# EAGLE schematic 40x24 (EAGLE 6.2), part 2 of 2
## Sheet 1 of 4 (continued)
### Nets (continued)
X5: Q29.1(G) ; also sheet 2
X6: Q30.1(G) ; also sheet 2
X7: Q31.1(G) ; also sheet 2
X8: Q32.1(G) ; also sheet 2
X9: Q33.1(G) ; also sheet 2
X10: Q34.1(G) ; also sheet 2
X11: Q35.1(G) ; also sheet 2
X12: Q36.1(G) ; also sheet 2
X13: Q37.1(G) ; also sheet 2
X14: Q38.1(G) ; also sheet 2
X15: Q39.1(G) ; also sheet 2
X16: Q40.1(G) ; also sheet 2
X17: Q41.1(G) ; also sheet 2
X18: Q42.1(G) ; also sheet 2
X19: Q43.1(G) ; also sheet 2
X20: Q44.1(G) ; also sheet 2
X21: Q45.1(G) ; also sheet 2
X22: Q46.1(G) ; also sheet 2
X23: Q47.1(G) ; also sheet 2
X24: Q48.1(G) ; also sheet 2
X25: Q49.1(G) ; also sheet 2
X26: Q50.1(G) ; also sheet 2
X27: Q51.1(G) ; also sheet 2
X28: Q52.1(G) ; also sheet 2
X29: Q53.1(G) ; also sheet 2
X30: Q54.1(G) ; also sheet 2
X31: Q55.1(G) ; also sheet 2
X32: Q56.1(G) ; also sheet 2
X33: Q57.1(G) ; also sheet 2
X34: Q58.1(G) ; also sheet 2
X35: Q59.1(G) ; also sheet 2
X36: Q60.1(G) ; also sheet 2
X37: Q61.1(G) ; also sheet 2
X38: Q62.1(G) ; also sheet 2
X39: Q63.1(G) ; also sheet 2
X40: Q64.1(G) ; also sheet 2
Y1: Q24.1(G) ; also sheet 2
Y2: Q23.1(G) ; also sheet 2
Y3: Q22.1(G) ; also sheet 2
Y4: Q21.1(G) ; also sheet 2
Y5: Q20.1(G) ; also sheet 2
Y6: Q19.1(G) ; also sheet 2
Y7: Q18.1(G) ; also sheet 2
Y8: Q17.1(G) ; also sheet 2
Y9: Q16.1(G) ; also sheet 2
Y10: Q15.1(G) ; also sheet 2
Y11: Q14.1(G) ; also sheet 2
Y12: Q13.1(G) ; also sheet 2
Y13: Q12.1(G) ; also sheet 2
Y14: Q11.1(G) ; also sheet 2
Y15: Q10.1(G) ; also sheet 2
Y16: Q9.1(G) ; also sheet 2
Y17: Q8.1(G) ; also sheet 2
Y18: Q7.1(G) ; also sheet 2
Y19: Q6.1(G) ; also sheet 2
Y20: Q5.1(G) ; also sheet 2
Y21: Q4.1(G) ; also sheet 2
Y22: Q3.1(G) ; also sheet 2
Y23: Q1.1(G) ; also sheet 2
Y24: Q65.1(G) ; also sheet 2
Unconnected: X2.3

## Sheet 2 of 4
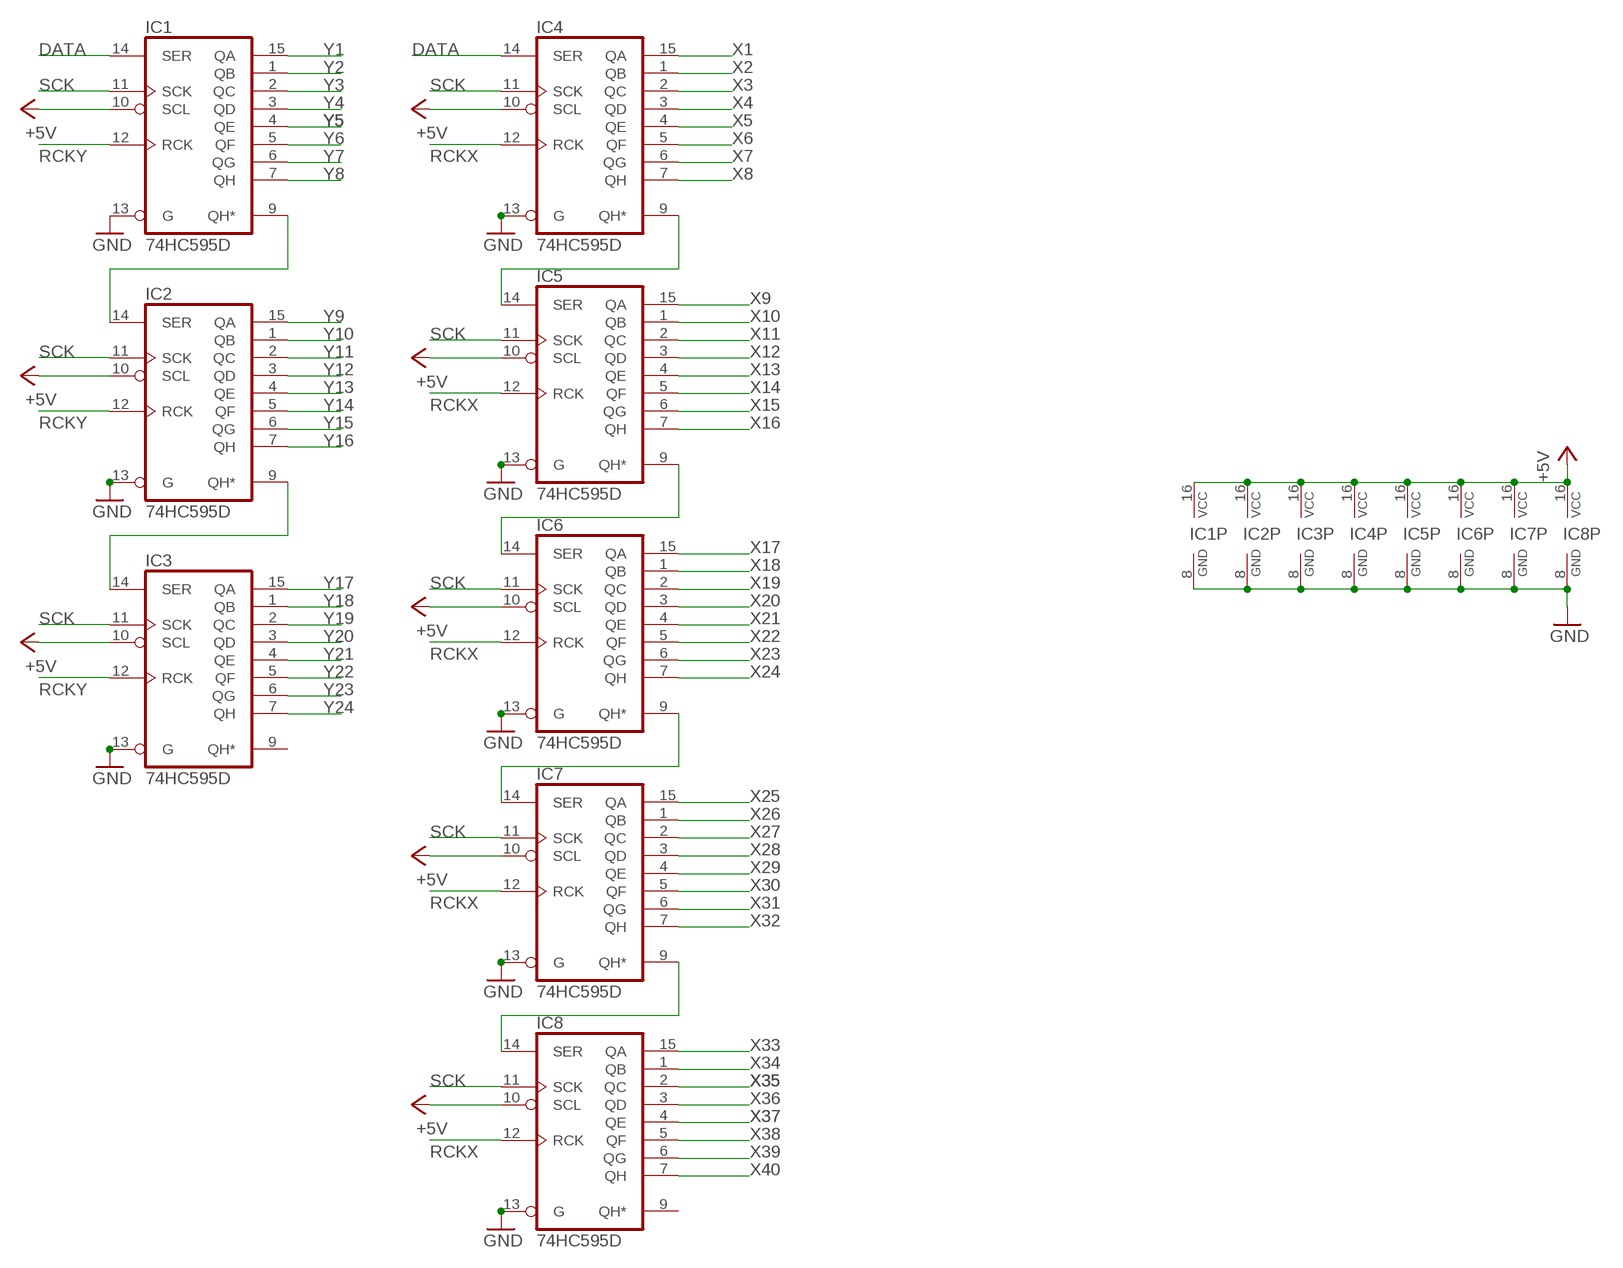
[diagram p1: schematic, sheet 2]

### Parts
IC1  74HC595D  [SO16]
IC2  74HC595D  [SO16]
IC3  74HC595D  [SO16]
IC4  74HC595D  [SO16]
IC5  74HC595D  [SO16]
IC6  74HC595D  [SO16]
IC7  74HC595D  [SO16]
IC8  74HC595D  [SO16]

### Nets
+5V: IC1.10(SCL) IC1.16(VCC) IC2.10(SCL) IC2.16(VCC) IC3.10(SCL) IC3.16(VCC) IC4.10(SCL) IC4.16(VCC) IC5.10(SCL) IC5.16(VCC) IC6.10(SCL) IC6.16(VCC) IC7.10(SCL) IC7.16(VCC) IC8.10(SCL) IC8.16(VCC) ; also sheet 1,3,4
DATA: IC1.14(SER) IC4.14(SER) ; also sheet 3
GND: IC1.8(GND) IC1.13(G) IC2.8(GND) IC2.13(G) IC3.8(GND) IC3.13(G) IC4.8(GND) IC4.13(G) IC5.8(GND) IC5.13(G) IC6.8(GND) IC6.13(G) IC7.8(GND) IC7.13(G) IC8.8(GND) IC8.13(G) ; also sheet 1,3,4
N$1: IC4.9(QH*) IC5.14(SER)
N$2: IC5.9(QH*) IC6.14(SER)
N$3: IC6.9(QH*) IC7.14(SER)
N$4: IC7.9(QH*) IC8.14(SER)
N$989: IC1.9(QH*) IC2.14(SER)
N$990: IC2.9(QH*) IC3.14(SER)
RCKX: IC4.12(RCK) IC5.12(RCK) IC6.12(RCK) IC7.12(RCK) IC8.12(RCK) ; also sheet 3
RCKY: IC1.12(RCK) IC2.12(RCK) IC3.12(RCK) ; also sheet 3
SCK: IC1.11(SCK) IC2.11(SCK) IC3.11(SCK) IC4.11(SCK) IC5.11(SCK) IC6.11(SCK) IC7.11(SCK) IC8.11(SCK) ; also sheet 3
X1: IC4.15(QA) ; also sheet 1
X2: IC4.1(QB) ; also sheet 1
X3: IC4.2(QC) ; also sheet 1
X4: IC4.3(QD) ; also sheet 1
X5: IC4.4(QE) ; also sheet 1
X6: IC4.5(QF) ; also sheet 1
X7: IC4.6(QG) ; also sheet 1
X8: IC4.7(QH) ; also sheet 1
X9: IC5.15(QA) ; also sheet 1
X10: IC5.1(QB) ; also sheet 1
X11: IC5.2(QC) ; also sheet 1
X12: IC5.3(QD) ; also sheet 1
X13: IC5.4(QE) ; also sheet 1
X14: IC5.5(QF) ; also sheet 1
X15: IC5.6(QG) ; also sheet 1
X16: IC5.7(QH) ; also sheet 1
X17: IC6.15(QA) ; also sheet 1
X18: IC6.1(QB) ; also sheet 1
X19: IC6.2(QC) ; also sheet 1
X20: IC6.3(QD) ; also sheet 1
X21: IC6.4(QE) ; also sheet 1
X22: IC6.5(QF) ; also sheet 1
X23: IC6.6(QG) ; also sheet 1
X24: IC6.7(QH) ; also sheet 1
X25: IC7.15(QA) ; also sheet 1
X26: IC7.1(QB) ; also sheet 1
X27: IC7.2(QC) ; also sheet 1
X28: IC7.3(QD) ; also sheet 1
X29: IC7.4(QE) ; also sheet 1
X30: IC7.5(QF) ; also sheet 1
X31: IC7.6(QG) ; also sheet 1
X32: IC7.7(QH) ; also sheet 1
X33: IC8.15(QA) ; also sheet 1
X34: IC8.1(QB) ; also sheet 1
X35: IC8.2(QC) ; also sheet 1
X36: IC8.3(QD) ; also sheet 1
X37: IC8.4(QE) ; also sheet 1
X38: IC8.5(QF) ; also sheet 1
X39: IC8.6(QG) ; also sheet 1
X40: IC8.7(QH) ; also sheet 1
Y1: IC1.15(QA) ; also sheet 1
Y2: IC1.1(QB) ; also sheet 1
Y3: IC1.2(QC) ; also sheet 1
Y4: IC1.3(QD) ; also sheet 1
Y5: IC1.4(QE) ; also sheet 1
Y6: IC1.5(QF) ; also sheet 1
Y7: IC1.6(QG) ; also sheet 1
Y8: IC1.7(QH) ; also sheet 1
Y9: IC2.15(QA) ; also sheet 1
Y10: IC2.1(QB) ; also sheet 1
Y11: IC2.2(QC) ; also sheet 1
Y12: IC2.3(QD) ; also sheet 1
Y13: IC2.4(QE) ; also sheet 1
Y14: IC2.5(QF) ; also sheet 1
Y15: IC2.6(QG) ; also sheet 1
Y16: IC2.7(QH) ; also sheet 1
Y17: IC3.15(QA) ; also sheet 1
Y18: IC3.1(QB) ; also sheet 1
Y19: IC3.2(QC) ; also sheet 1
Y20: IC3.3(QD) ; also sheet 1
Y21: IC3.4(QE) ; also sheet 1
Y22: IC3.5(QF) ; also sheet 1
Y23: IC3.6(QG) ; also sheet 1
Y24: IC3.7(QH) ; also sheet 1
Unconnected: IC3.9(QH*) IC8.9(QH*)

## Sheet 3 of 4
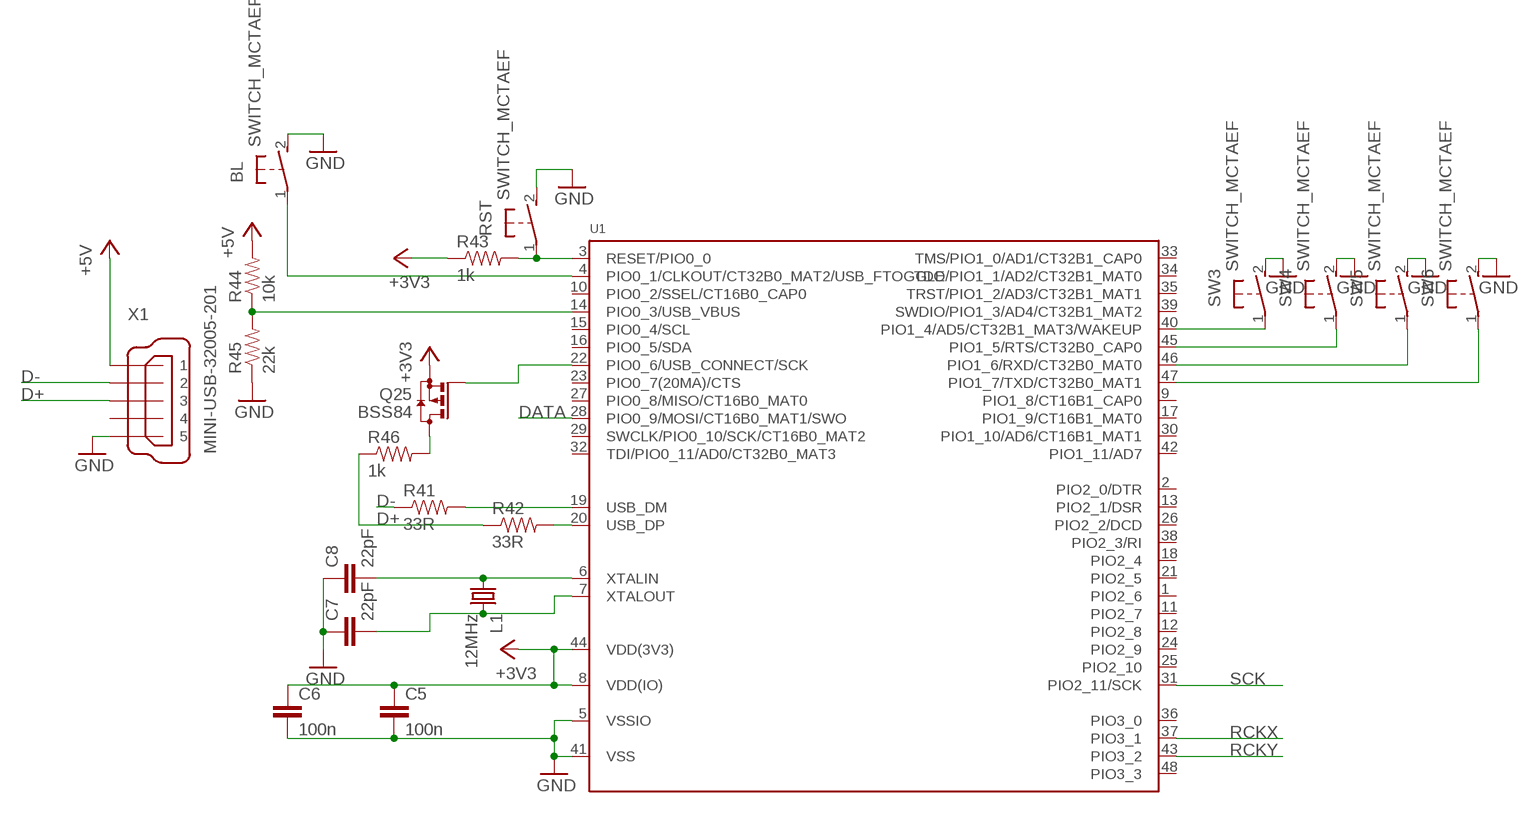
[diagram p2: schematic, sheet 3]

### Parts
BL  SWITCH_MCTAEF  [SWITCH_MCTAEF]
C5  100n  CAP0805  [0805]
C6  100n  CAP0805  [0805]
C7  22pF  CAP0805  [0805]
C8  22pF  CAP0805  [0805]
L1  12MHz  X22-OSCILLATOR  [X22]
Q25  BSS84  [SOT23]
R41  33R  RESISTOR0805-RES  [0805]
R42  33R  RESISTOR0805-RES  [0805]
R43  1k  RESISTOR0805-RES  [0805]
R44  10k  RESISTOR0805-RES  [0805]
R45  22k  RESISTOR0805-RES  [0805]
R46  1k  RESISTOR0805-RES  [0805]
RST  SWITCH_MCTAEF  [SWITCH_MCTAEF]
SW3  SWITCH_MCTAEF  [SWITCH_MCTAEF]
SW4  SWITCH_MCTAEF  [SWITCH_MCTAEF]
SW5  SWITCH_MCTAEF  [SWITCH_MCTAEF]
SW6  SWITCH_MCTAEF  [SWITCH_MCTAEF]
U1  LPC1343_QFP  [LQFP48]
X1  MINI-USB-32005-201  [32005-201]

### Nets
+3V3: C5.1 C6.1 Q25.2(S) R43.1 U1.8(VDD(IO)) U1.44(VDD(3V3)) ; also sheet 4
+5V: R44.2 X1.1 ; also sheet 1,2,4
D+: R42.1 R46.1 X1.3
D-: R41.1 X1.2
DATA: U1.28(PIO0_9/MOSI/CT16B0_MAT1/SWO) ; also sheet 2
GND: BL.2 C5.2 C6.2 C7.1 C8.1 R45.1 RST.2 SW3.2 SW4.2 SW5.2 SW6.2 U1.5(VSSIO) U1.41(VSS) X1.5 ; also sheet 1,2,4
N$40: R42.2 U1.20(USB_DP)
N$51: R41.2 U1.19(USB_DM)
N$52: R43.2 RST.1 U1.3(RESET/PIO0_0)
N$53: C7.2 L1.3 U1.7(XTALOUT)
N$54: C8.2 L1.1 U1.6(XTALIN)
N$55: BL.1 U1.4(PIO0_1/CLKOUT/CT32B0_MAT2/USB_FTOGGLE)
N$56: SW3.1 U1.40(PIO1_4/AD5/CT32B1_MAT3/WAKEUP)
N$57: SW4.1 U1.45(PIO1_5/RTS/CT32B0_CAP0)
N$58: Q25.1(G) U1.22(PIO0_6/USB_CONNECT/SCK)
N$59: R44.1 R45.2 U1.14(PIO0_3/USB_VBUS)
N$60: Q25.3(D) R46.2
N$61: SW5.1 U1.46(PIO1_6/RXD/CT32B0_MAT0)
N$62: SW6.1 U1.47(PIO1_7/TXD/CT32B0_MAT1)
RCKX: U1.37(PIO3_1) ; also sheet 2
RCKY: U1.43(PIO3_2) ; also sheet 2
SCK: U1.31(PIO2_11/SCK) ; also sheet 2
Unconnected: U1.1(PIO2_6) U1.2(PIO2_0/DTR) U1.9(PIO1_8/CT16B1_CAP0) U1.10(PIO0_2/SSEL/CT16B0_CAP0) U1.11(PIO2_7) U1.12(PIO2_8) U1.13(PIO2_1/DSR) U1.15(PIO0_4/SCL) U1.16(PIO0_5/SDA) U1.17(PIO1_9/CT16B1_MAT0) U1.18(PIO2_4) U1.21(PIO2_5) U1.23(PIO0_7(20MA)/CTS) U1.24(PIO2_9) U1.25(PIO2_10) U1.26(PIO2_2/DCD) U1.27(PIO0_8/MISO/CT16B0_MAT0) U1.29(SWCLK/PIO0_10/SCK/CT16B0_MAT2) U1.30(PIO1_10/AD6/CT16B1_MAT1) U1.32(TDI/PIO0_11/AD0/CT32B0_MAT3) U1.33(TMS/PIO1_0/AD1/CT32B1_CAP0) U1.34(TDO/PIO1_1/AD2/CT32B1_MAT0) U1.35(TRST/PIO1_2/AD3/CT32B1_MAT1) U1.36(PIO3_0) U1.38(PIO2_3/RI) U1.39(SWDIO/PIO1_3/AD4/CT32B1_MAT2) U1.42(PIO1_11/AD7) U1.48(PIO3_3) X1.4

## Sheet 4 of 4
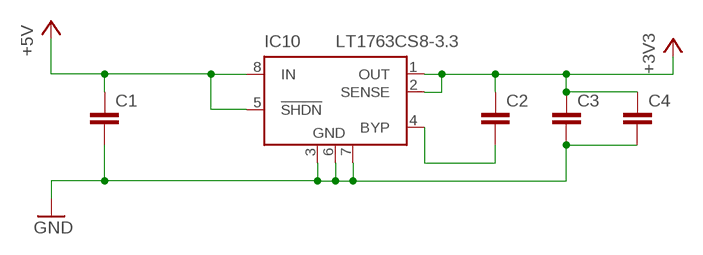
[diagram p3: schematic, sheet 4]

### Parts
C1  CAP0805  [0805]
C2  CAP0805  [0805]
C3  CAP0805  [0805]
C4  CAP0805  [0805]
IC10  LT1763CS8-3.3  [SOIC8]

### Nets
+3V3: C2.1 C3.1 C4.1 IC10.1(OUT) IC10.2(SENSE) ; also sheet 3
+5V: C1.1 IC10.5(!SHDN) IC10.8(IN) ; also sheet 1,2,3
GND: C1.2 C3.2 C4.2 IC10.3(GND) IC10.6(GND) IC10.7(GND) ; also sheet 1,2,3
N$41: C2.2 IC10.4(BYP)

## Library data of the parts
BL RST SW3-SW6 = seb:SWITCH_MCTAEF
C1-C8 = SparkFun:CAP: Capacitor Standard 0603 ceramic capacitor, and 0.1" leaded capacitor.
IC1-IC8 = 74xx-eu:74*595: 8-bit SHIFT REGISTER, output latch
IC10 = linear-technology:LT1763CS8: 500mA, Low Noise, LDO Micropower Regulators Source: http://cds.linear.com/docs/Datasheet/1763ff.pdf; MPN: LT1763CS8-3.3; OC_FARNELL: 1273617; OC_NEWARK: 57M6055
JP2 = pinhead:PINHD-1X2: PIN HEADER
L1 = seb:X22-OSCILLATOR
LED1-LED960 = led:LED: LED OSRAM: - CHIPLED LG R971, LG N971, LY N971, LG Q971, LY Q971, LO R971, LY R971 LH N974, LH R974 LS Q976, LO Q976, LY Q976 LO Q996 - Hyper CHIPLED LW Q18S LB Q993, LB Q99A, LB R99A - SideLED LS A670, LO A670, LY A670, LG A670, LP A670 LB A673, LV A673, LT A673, LW A673 LH A674 LY A675 LS A676, LA A676, LO A676, LY A676, LW A676 LS A679, LY A679, LG A679 - Hyper Micro SIDELED® LS Y876, LA Y876, LO Y876, LY Y876 LT Y87S - SmartLED LW L88C, LW L88S LB L89C, LB L89S, LG L890 LS L89K, LO L89K, LY L89K LS L896, LA L896, LO L896, LY L896 - TOPLED LS T670, LO T670, LY T670, LG T670, LP T670 LSG T670, LSP T670, LSY T670, LOP T670, LYG T670 LG T671, LOG T671, LSG T671 LB T673, LV T673, LT T673, LW T673 LH T674 LS T676, LA T676, LO T676, LY T676, LB T676, LH T676, LSB T676, LW T676 LB T67C, LV T67C, LT T67C, LS T67K, LO T67K, LY T67K, LW E67C LS E67B, LA E67B, LO E67B, LY E67B, LB E67C, LV E67C, LT E67C LW T67C LS T679, LY T679, LG T679 LS T770, LO T770, LY T770, LG T770, LP T770 LB T773, LV T773, LT T773, LW T773 LH T774 LS E675, LA E675, LY E675, LS T675 LS T776, LA T776, LO T776, LY T776, LB T776 LHGB T686 LT T68C, LB T68C - Hyper Mini TOPLED® LB M676 - Mini TOPLED Santana® LG M470 LS M47K, LO M47K, LY M47K Source: http://www.osram.convergy.de LUXEON: - LUMILED® LXK2-PW12-R00, LXK2-PW12-S00, LXK2-PW14-U00, LXK2-PW14-V00 LXK2-PM12-R00, LXK2-PM12-S00, LXK2-PM14-U00 LXK2-PE12-Q00, LXK2-PE12-R00, LXK2-PE12-S00, LXK2-PE14-T00, LXK2-PE14-U00 LXK2-PB12-K00, LXK2-PB12-L00, LXK2-PB12-M00, LXK2-PB14-N00, LXK2-PB14-P00, LXK2-PB14-Q00 LXK2-PR12-L00, LXK2-PR12-M00, LXK2-PR14-Q00, LXK2-PR14-R00 LXK2-PD12-Q00, LXK2-PD12-R00, LXK2-PD12-S00 LXK2-PH12-R00, LXK2-PH12-S00 LXK2-PL12-P00, LXK2-PL12-Q00, LXK2-PL12-R00 Source: www.luxeon.com KINGBRIGHT: KA-3528ASYC Source: www.kingbright.com
Q1 Q3-Q24 Q65 = microbuilder:MOSFET-P: P-Channel Mosfet SOT-23 IRLML5103 30V 760mA 1V Vgs - Digikey: IRLML5103PBFCT-ND NTR0202PL 20V 400mA 2.3V Vgs - Digikey: NTR0202PLT1GOSTR-ND NTR4101PT1G 20V 1.8A 1.2V Vgs - Digikey: NTR4101PT1GOSCT-ND DMP2004K 20V 600mA 1V Vgs - Digikey: DMP2004KDICT-ND
Q2 Q26-Q64 = microbuilder:MOSFET-N: N-Channel Mosfet 2N7002E - 60V 260mA SOT23 [Digikey: 2N7002ET1GOSTR-ND] BSH103 - 30V 850mA SOT23 [Digikey: 568-5013-1-ND]
Q25 = transistor-small-signal:BSS84: P-CHANNEL MOS FET
R1-R46 = SparkFun:RESISTOR: Resistor Basic schematic elements and footprints for 0603, 1206, and PTH resistors.
U1 = microbuilder:LPC1343_QFP: LPC1343 72 MHz 32-bit ARM Cortex-M3 microcontroller. 32 kB Flash, 8 kB SRAM, USB Device Mouser: 771-LPC1343FBD48151 Digikey: 568-4945-ND; DIGIKEY#: 568-4945-ND; MANF: NXP; MANF#: LPC1343FBD48,151
X1 = con-cypressindustries:MINI-USB-: MINI USB-B Conector Source: www.cypressindustries.com; OC_FARNELL: unknown; OC_NEWARK: unknown
X2 = con-conrad:73398?: FEMALE PRINT CONNECTOR Niedervolt-Steckverbinder Distributor Conrad